# Altium schematic sheet IMU.SchDoc: IMU - Group 12
size A3; DrawnBy: William Johanson, Flynn Hill; Address1: ECE Department; Address2: University of Canterbury; Address3: Christchurch 8041; Address4: New Zealand; Revision: 1
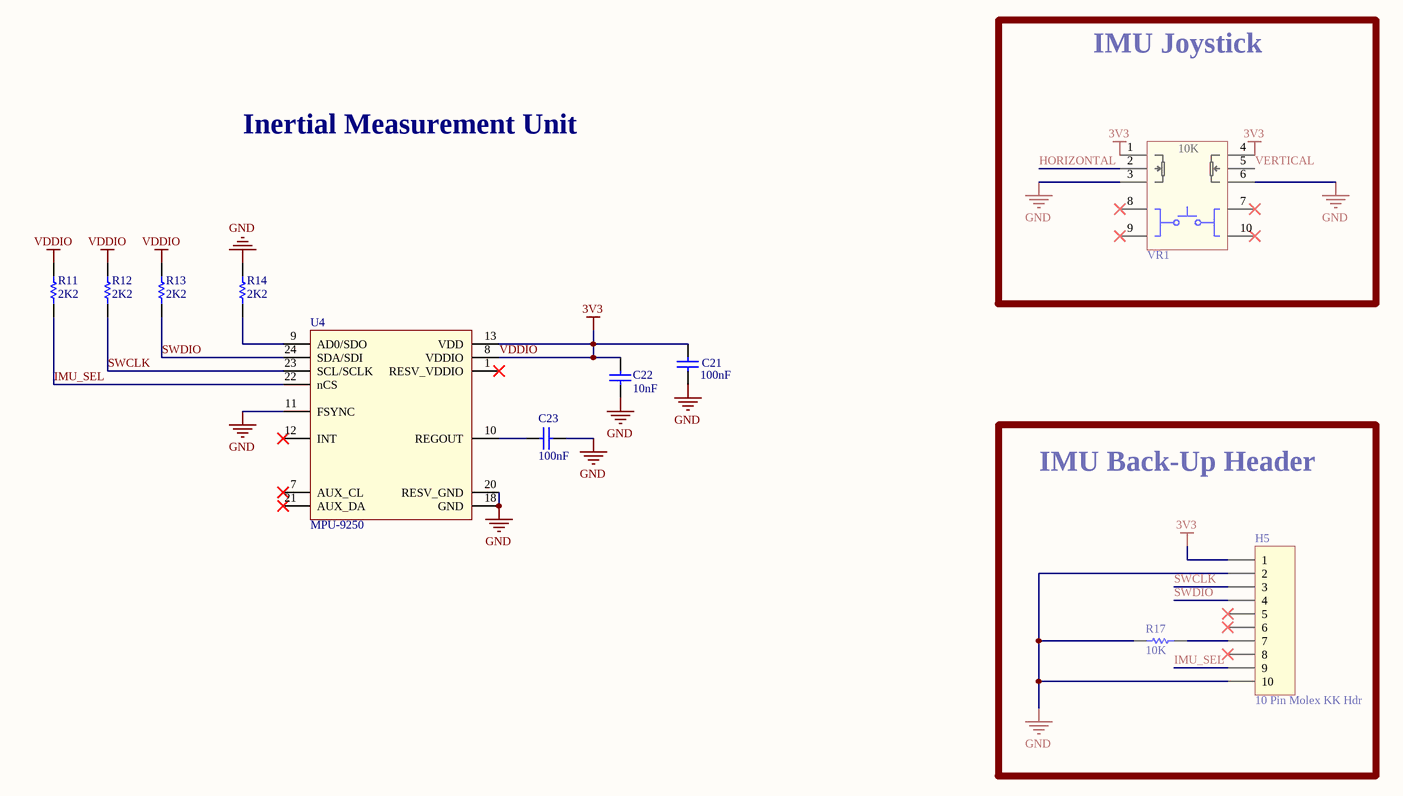
[diagram p0: IMU.SchDoc]

## Parts
C21  100nF  [CAPC1608L]
C22  10nF  [CAPC1608L]
C23  100nF  [CAPC1608L]
H5  10 Pin Molex KK Hdr  [MOLEX_KK_10_HDR]
R11  2K2  [RESC1608L]
R12  2K2  [RESC1608L]
R13  2K2  [RESC1608L]
R14  2K2  [RESC1608L]
R17  10K  [RESC1608L]
U4  MPU-9250  [Quad24]
VR1  Joystick 10k with Sw  [Joystick_Sw]  (value not drawn)

## Blocks framed on the sheet
IMU Joystick: VR1
IMU Back-Up Header: H5 R17

## Nets
GND: C21.1 C22.1 C23.2 H5.2 H5.10 R14.2 R17.1 U4.11(FSYNC) U4.18(GND) U4.20(RESV_GND) VR1.3 VR1.6(3')
VDDIO: C21.2 C22.2 H5.1 R11.2 R12.2 R13.2 U4.8(VDDIO) U4.13(VDD) VR1.1 VR1.4(1')  [also labelled 3V3]
HORIZONTAL: VR1.2
IMU_SEL: H5.9 R11.1 U4.22(nCS)
SWCLK: H5.3 R12.1 U4.23(SCL/SCLK)
SWDIO: H5.4 R13.1 U4.24(SDA/SDI)
VERTICAL: VR1.5(2')
NetC23_1: C23.1 U4.10(REGOUT)
NetH5_7: H5.7 R17.2
NetR14_1: R14.1 U4.9(AD0/SDO)

Not connected (* = marked no-connect by the designer): H5 5* 6* 8*; U4 1(RESV_VDDIO)* 7(AUX_CL)* 12(INT)* 21(AUX_DA)*; VR1 7* 8* 9* 10*

## Notes on the sheet
- Inertial Measurement Unit
- Title
- Drawn by:
- Date:
- Time:
- Revision:
- Sheet
- of
- File:
- (in symbol Joystick 10k with Sw) 10K

## Library data of the parts
C21 C23 = CC_100nF_0603: CAP CER 100nF X7R +-10% 50V 0603; PackageReference: 0603; Code_IPC: 1608 [0603]; Verify: *; Supplier: ECE Dept; Storage Location: PCB Assembly WS; Value: 100nF
C22 = CC_10nF_0603: CAP CER 10nF X7R +-10% 50V 0603; PackageReference: 0603; Code_IPC: 1608 [0603]; Verify: *; Supplier: ECE Dept; Storage Location: PCB Assembly WS; Value: 10nF
H5 = JA_MOLEX_KK_10POS: CONN HEADER 10POS 2.54mm VERT_ Thru Hole; Supplier 1: Farnell; Supplier Part Number 1: 1756828; Supplier: ECE Dept; Storage Location: ECE Dept Store; Value: 10 Pin Molex KK Hdr
R11-R14 = RS_2K2: RES 2.2K OHM 1/10W 5% 0603 SMD; Storage Location: PCB Assembly WS; Supplier: ECE Dept; Value: 2K2
R17 = RS_10K: RES 10.0K OHM 1/10W 5% 0603 SMD; Storage Location: PCB Assembly WS; Supplier: ECE Dept; Value: 10K
U4 = MPU-9250: 9 axis IMU
VR1 = Joystick 10k with Sw: JOYSTICK 10K OHM 2 AXIS TH; Manufacturer 1: SparkFun; Manufacturer Part Number 1: COM-09032; Supplier 1: Digi-Key; Stock 1: 563; Pricing 1: 1=3.95000 (USD); RoHS: No; ComponentLink1URL: https://media.digikey.com/pdf/Data%20Sheets/Sparkfun%20PDFs/COM-09032_Web.pdf?src-supplier=Digi-Key; ComponentLink1Description: https://media.digikey.com/pdf/Data%20Sheets/Sparkfun%20PDFs/COM-09032_Web.pdf?src-supplier=Digi-Key; Supplier Part Number 1: 1568-1526-ND